# EAGLE design rev2 (EAGLE 8.1.0)
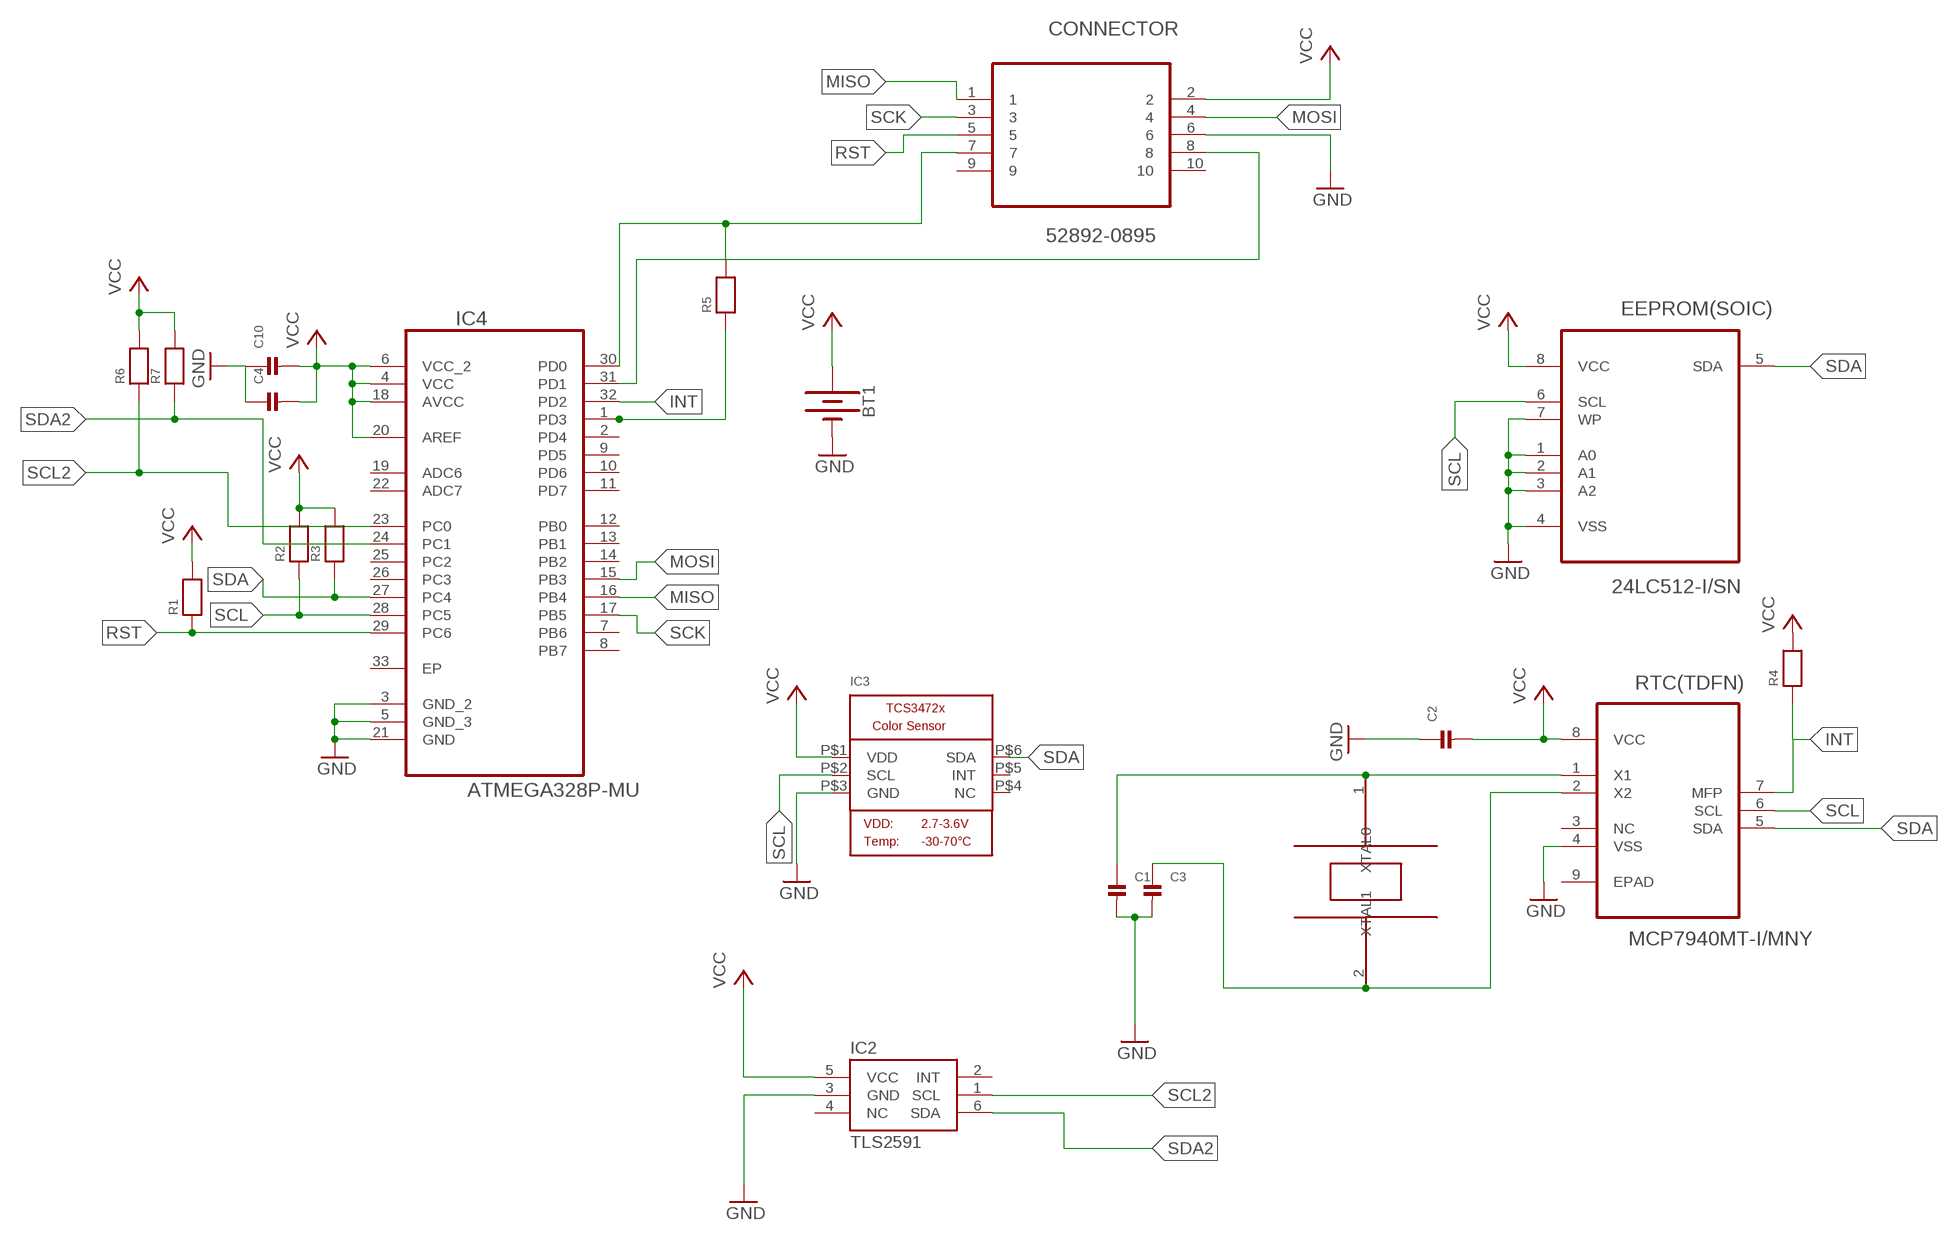
[diagram p0: schematic, sheet 1]

## Parts
BT1  BATTERY-20MM_SMD_4LEGS  [BATTCON_20MM_4LEGS]
C1  CAP_CERAMIC0402  [0402]
C2  CAP_CERAMIC0402  [0402]
C3  CAP_CERAMIC0402  [0402]
C4  CAP_CERAMIC0402  [0402]
C10  CAP_CERAMIC0402  [0402]
CONNECTOR  52892-0895  [MOLEX_52892-0895]
EEPROM(SOIC)  24LC512-I/SN  [SOIC127P600X175-8N]
IC2  TLS2591  [WFDFN6]
IC3  LIGHT_TCS3472  [TCS3472_FN6]
IC4  ATMEGA328P-MU  [QFN50P500X500X100-33N]
R1  RESISTOR0402  [0402]
R2  RESISTOR0402  [0402]
R3  RESISTOR0402  [0402]
R4  RESISTOR0402  [0402]
R5  RESISTOR0402  [0402]
R6  RESISTOR0402  [0402]
R7  RESISTOR0402  [0402]
RTC(TDFN)  MCP7940MT-I/MNY  [TDFN300X200X80-9N]
U$2  FC-135R  [FC-135R]

## Nets
GND: BT1.NEGATIVE(-) C1.2 C2.1 C3.2 C4.1 C10.1 CONNECTOR.6 EEPROM(SOIC).1(A0) EEPROM(SOIC).2(A1) EEPROM(SOIC).3(A2) EEPROM(SOIC).4(VSS) EEPROM(SOIC).7(WP) IC2.3(GND) IC3.P$3(GND) IC4.3(GND_2) IC4.5(GND_3) IC4.21(GND) RTC(TDFN).4(VSS)
INT: IC4.32(PD2) R4.1 RTC(TDFN).7(MFP)
MISO: CONNECTOR.1 IC4.16(PB4)
MOSI: CONNECTOR.4 IC4.15(PB3)
N$1: IC4.1(PD3) R5.1
N$2: C3.1 RTC(TDFN).2(X2) U$2.2(XTAL1)
N$3: C1.1 RTC(TDFN).1(X1) U$2.1(XTAL0)
N$4: CONNECTOR.7 IC4.30(PD0) R5.2
N$5: CONNECTOR.8 IC4.31(PD1)
RST: CONNECTOR.5 IC4.29(PC6) R1.1
SCK: CONNECTOR.3 IC4.17(PB5)
SCL: EEPROM(SOIC).6(SCL) IC3.P$2(SCL) IC4.28(PC5) R2.1
SCL2: IC2.1(SCL) IC4.23(PC0) R6.1
SDA: EEPROM(SOIC).5(SDA) IC3.P$6(SDA) IC4.27(PC4) R3.1 RTC(TDFN).5(SDA)
SDA2: IC2.6(SDA) IC4.24(PC1) R7.1
VCC: BT1.POSITIVE@1(+) BT1.POSITIVE@2(+) BT1.POSITIVE@3(+) BT1.POSITIVE@4(+) C2.2 C4.2 C10.2 CONNECTOR.2 EEPROM(SOIC).8(VCC) IC2.5(VCC) IC3.P$1(VDD) IC4.4(VCC) IC4.6(VCC_2) IC4.18(AVCC) IC4.20(AREF) R1.2 R2.2 R3.2 R4.2 R6.2 R7.2 RTC(TDFN).8(VCC)
Unconnected: CONNECTOR.9 CONNECTOR.10 IC2.2(INT) IC2.4(NC) IC3.P$4(NC) IC3.P$5(INT) IC4.2(PD4) IC4.7(PB6) IC4.8(PB7) IC4.9(PD5) IC4.10(PD6) IC4.11(PD7) IC4.12(PB0) IC4.13(PB1) IC4.14(PB2) IC4.19(ADC6) IC4.22(ADC7) IC4.25(PC2) IC4.26(PC3) IC4.33(EP) RTC(TDFN).3(NC) RTC(TDFN).6(SCL) RTC(TDFN).9(EPAD)

## Library data of the parts
BT1 = SparkFun-Batteries:BATTERY: Battery - Single Cell A variety of battery chemistries, sizes, and footprints. Device List: 20MM_PTH - Coin Cell Battery Holder - 20mm (PTH) <https://www.sparkfun.com/products/783> 12MM_SMD - Coin Cell Battery Holder - 12mm (SMD) <https://www.sparkfun.com/products/10592> 12MM_PTH - Coin Cell Battery Holder - 12mm (PTH) <https://www.sparkfun.com/products/7948> 20MM_SMD - 20mm Coin Cell Battery Holder (SMD) (2 legs) Used on the Big Time Watch Kit <https://www.sparkfun.com/products/11734> 20MM_SMD_4LEGS - Coin Cell Battery Holder - 20mm (SMD) <https://www.sparkfun.com/products/11892> 20MM_SMD_4LEGS_OVERPASTE - Coin Cell Battery Holder - 20mm (SMD) <https://www.sparkfun.com/products/11892> (Over-paste on the legs) 24.5MM_PTH - Coin Cell Battery Holder - 24.5mm (PTH) <https://www.sparkfun.com/products/8863> 9V - 9V Battery Holder - PC Mount Used on the SparkFun SparkPunk Sound Kit <https://www.sparkfun.com/products/11177> and SparkFun SparkPunk Sequencer Kit <https://www.sparkfun.com/products/12707> 18650 - Battery Holder - 18650 (PTH) <https://www.sparkfun.com/products/13113> AA - Battery Holder - 1xAA (PTH) <https://www.sparkfun.com/products/7949> AAA - Battery Holder - 1xAAA (PTH) <https://www.sparkfun.com/products/12718> AA_KIT - Battery Holder - 1xAA (PTH) <https://www.sparkfun.com/products/7949> Special kit package - pads only have exposed copper on one side of the board. AAA_KIT - Battery Holder - 1xAAA (PTH) <https://www.sparkfun.com/products/12718> Special kit package - pads only have exposed copper on one side of the board.; PROD_ID: BATT-10373; SF_SKU: PRT-11892
C1-C4 C10 = microbuilder:CAP_CERAMIC: Ceramic Capacitors 0402 - 0402 Surface Mount Capacitors 16pF 50V 5% [Digikey: 445-4899-2-ND] 18pF 50V 5% [Digikey: 490-1281-2-ND] 22pF 50V 5% [Digikey: 490-1283-2-ND] 68pF 50V 5% [Digikey: 490-1289-2-ND] 0.1uF 10V 10% [Digikey: 490-1318-2-ND] 1.0uF 6.3V 10% [Digikey: 490-1320-2-ND] 0603 - 0603 Surface Mount Capacitors 16 pF 50V 5% [Digikey: 445-5051-2-ND] 22 pF 50V [Digikey: PCC220ACVTR-ND] 33 pF 50V 5% [Digikey: 490-1415-1-ND] 56pF 50V 5% [Digikey: 490-1421-1-ND] 220pF 50V 5% [Digikey: 445-1285-1-ND] 680 pF 50V 2200 pF 50V 5% C0G [Digikey: 445-1297-1-ND] 5600 pF 100V 5% X7R [Digikey: 478-3711-1-ND] 0.1 µF 25V 10% [Digikey: PCC2277TR-ND] 0.22 µF 16V 10% X7R [Digikey: 445-1318-1-ND] 1.0 µF 25V 10% [Digikey: 445-5146-2-ND] 0603 - RF Specific 3pF 250V +/-0.1pF RF [Digikey: 712-1347-1-ND] 18 pF 250V 5% [Digikey: 478-3505-1-ND or 712-1322-1-ND] 56 pF 250V 5% C0G RF [Digikey: 490-4867-1-ND] 68 pF 250V RF [Digikey: 490-4868-1-ND] 0805 - 0805 Surface Mount Capacitors 220 pF 250V 2% RF Ceramic Capacitor [Digikey: 712-1398-1-ND] 1000 pF 50V 2% NP0 Ceramic Capacitor [Digikey: 478-3760-1-ND] 0.1 µF 25V 10% Ceramic Capacitor [Digikey: PCC1828TR-ND] 1.0 µF 16V 10% Ceramic Capacitor[Digikey: 490-1691-2-ND] 10.0 µF 10V 10% Ceramic Capacitor[Digikey: 709-1228-1-ND] 10.0 uF 16V 10% Ceramic Capacitor [Digikey: 478-5165-2-ND] 47 uF 6.3V 20% Ceramic Capacitor [Digikey: 587-1779-1-ND or 399-5506-1-ND] 1206 - 1206 Surface Mount Capacitors 47uF 10V 20% Ceramic Capacitor [Digikey: 490-5528-1-ND or 399-5508-1-ND or 445-6010-1-ND] 100uF 6.3V -20%, +80% Y5V Ceramic Capacitor (Digikey: 490-4512-1-ND, Mouser: 81-GRM31CF50J107ZE1L)
CONNECTOR = molex:52892-0895: CONNECTOR, FPC, ZIF, 0.50MM, 08 WAY; MPN: 52892-0895; OC_FARNELL: 1556803; OC_NEWARK: 95M2692; PACKAGE: CONNECTOR, FPC, ZIF, 0.50MM, 08 WAY; SUPPLIER: Molex
EEPROM(SOIC) = Microchip-24LCxxx:24LC: IC, I2C™ Serial EEPROM; MPN: 24LC512-I/SN; OC_FARNELL: 1801220; OC_NEWARK: 08R2186; PACKAGE: SOIC-8; SUPPLIER: MICROCHIP
IC2 = we-sensor:TLS2591: AMS TSL2591 Light-to-Digital Converter
IC3 = microbuilder:LIGHT_TCS3472: TCS3472 RGB + Clear Color Sensor VDD: 2.7-3.6V Temp: -30 - 70°C IR light blocking filter 3,800,000:1 Dynamic Range 2.5µA sleep state Part IDs TCS34725: I2C bus logic = VDD, I2C address: 0x29 TCS34727: I2C bus logic = 1.8V, I2C address: 0x29
IC4 = 328p:ATMEGA328P-MU: Programmable Flash; MPN: ATMEGA328P-MU; OC_FARNELL: 1748522; OC_NEWARK: 26R2526; PACKAGE: QFN-32; SUPPLIER: Atmel
R1-R7 = microbuilder:RESISTOR: Resistors 0402 - 0402 Surface Mount Package 22 Ohm 1% 1/16W [Digikey: 311-22.0LRTR-ND] 33 Ohm 5% 1/16W 1.0K 5% 1/16W 1.5K 5% 1/16W 2.0K 1% 1/16W 10.0K 1% 1/16W [Digikey: 311-10.0KLRTR-ND] 10.0K 5% 1/16W [Digikey: RMCF0402JT10K0TR-ND] 12.1K 1% 1/16W [Digikey: 311-22.0LRTR-ND] 100.0K 5% 1/16W 0603 - 0603 Surface Mount Package 0 Ohm 1/10 Watt 1% Resistor 15 Ohm 1/10 Watt 1% Resistor 33 Ohm 1/10 Watt 1% Resistor 49.9 Ohm 1/10 Watt 1% Resistor 100 Ohm 1/10 Watt 1% Resistor 150 Ohm 1/10 Watt 1% Resistor 240 Ohm 1/10 Watt 1% Resistor 390 Ohm 1/10 Watt 1% Resistor 560 Ohm 1/10 Watt 1% Resistor 680 Ohm 1/10 Watt 1% Resistor 750 Ohm 1/10 Watt 1% Resistor 1.0K Ohm 1/10 Watt 1% Resistor 1.5K Ohm 1/10 Watt 1% Resistor 2.0K Ohm 1/10 Watt 1% Resistor 2.2K Ohm 1/10 Watt 1% Resistor 3.3K Ohm 1/10 Watt 1% Resistor 4.7K Ohm 1/10 Watt 1% Resistor 10.0K Ohm 1/10 Watt 1% Resistor 12.0K Ohm 1/10 Watt 1% Resistor 12.1K Ohm 1/10 Watt 1% Resistor 20.0K Ohm 1/10 Watt 1% Resistor 33.0K Ohm 1/10 Watt 1% Resistor 100.0K Ohm 1/10 Watt 1% Resistor 0805 - 0805 Surface Mount Package 0 Ohm 1/8 Watt 1% Resistor 33 Ohm 1/8 Watt 1% Resistor 100 Ohm 1/8 Watt 1% Resistor 150 Ohm 1/8 Watt 1% Resistor 200 Ohm 1/8 Watt 1% Resistor 240 Ohm 1/8 Watt 1% Resistor 330 Ohm 1/8 Watt 1% Resistor 390 Ohm 1/8 Watt 1% Resistor 470 Ohm 1/8 Watt 1% Resistor 1.0K Ohm 1/8 Watt 1% Resistor 1.5K Ohm 1/8 Watt 1% Resistor 2.0K Ohm 1/8 Watt 1% Resistor 4.7K Ohm 1/8 Watt 1% Resistor 5.1K Ohm 1/8 Watt 1% Resistor 5.6K Ohm 1/8 Watt 1% Resistor 10.0K Ohm 1/8 Watt 1% Resistor 22.0K Ohm 1/8 Watt 1% Resistor 33.0K Ohm 1/8 Watt 1% Resistor 100K Ohm 1/8 Watt 1% Resistor 1206 - 1206 Surface Mount Package 2012 - 2010 Surface Mount Package 0.11 Ohm 1/2 Watt 1% Resistor - Digikey: RHM.11UCT-ND
RTC(TDFN) = RTC:MCP7940MT-I/MNY: RTC, I2C, 64BYTES SRAM, 8TDFN; MPN: MCP7940MT-I/MNY; OC_FARNELL: 2098893; OC_NEWARK: 79T6326; PACKAGE: TDFN-8; SUPPLIER: Microchip
U$2 = ntnu_lysprosjekt:FC-135R

## Board
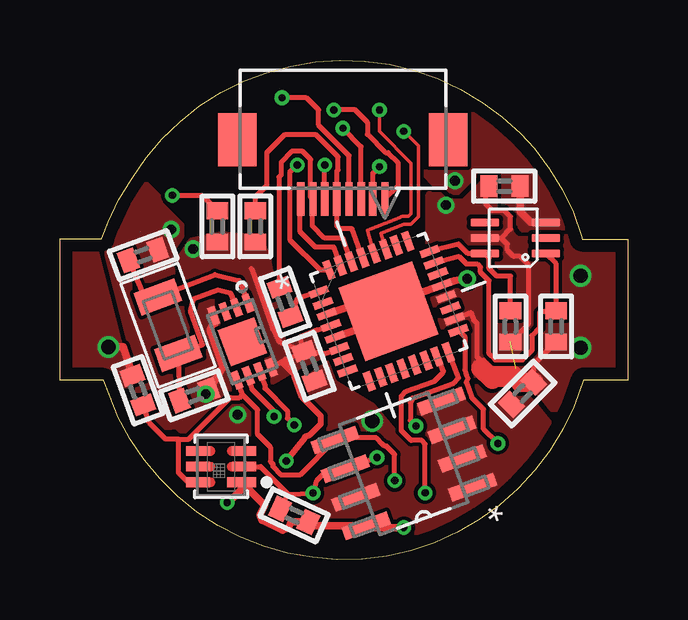
[diagram p1: board, top side]
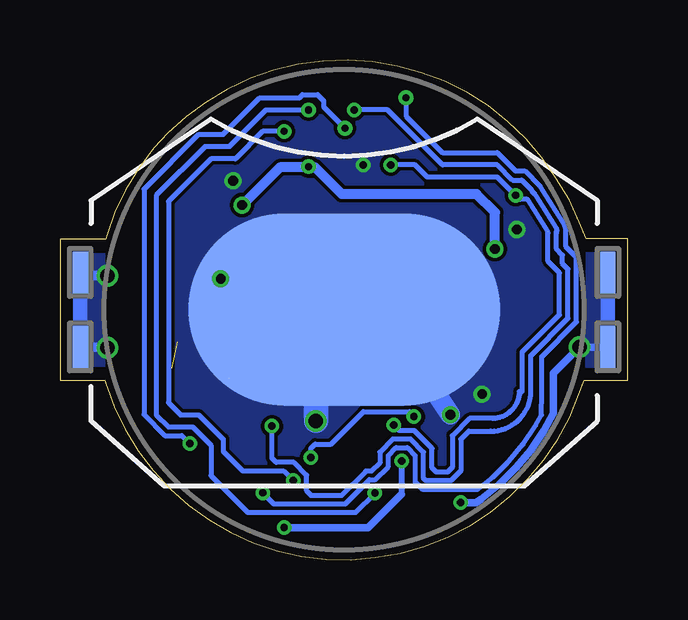
[diagram p2: board, bottom side, seen from below]

Size 23.69 x 20.83 mm. Coordinates in mm from the lower left corner, seen from the top.
Outline: 0,13.37 1.74,13.37 2.02,14.07 2.45,15.01 3.01,15.9 3.59,16.76 4.25,17.55 5.02,18.26 5.83,18.92 6.72,19.48 7.63,19.94 8.62,20.29 9.61,20.57 10.66,20.75 11.67,20.83 12.71,20.78 13.75,20.65 14.77,20.4 15.74,20.07 16.7,19.61 17.59,19.08 18.43,18.47 19.19,17.78 19.77,17.15 20.41,16.31 20.94,15.42 21.4,14.48 21.73,13.51 21.78,13.36 23.69,13.36 23.69,7.49 21.83,7.49 21.78,7.37 21.43,6.38 20.97,5.44 20.43,4.55 19.8,3.73 19.09,2.97 18.33,2.29 17.46,1.68 16.57,1.14 15.63,0.71 14.64,0.38 13.63,0.15 12.59,0.03 11.54,0 10.53,0.1 9.49,0.28 8.5,0.56 7.53,0.94 6.59,1.42 5.73,1.98 4.92,2.64 4.18,3.38 3.52,4.17 2.93,5.03 2.43,5.94 2.04,6.91 1.82,7.48 0,7.48 0,13.37
Copper layers (1*16): Top 0.035mm / dielectric 1.6mm / Bottom 0.035mm
Design rules "Elecrow_2-layer_PCB_eagle_rule": minimum track width 6mil, minimum drill 12mil, track to track 6mil, track to pad 6mil, pad to pad 6mil, via to via 8mil, smd to smd 0mil, copper to edge 20mil, drill to drill 10mil, minimum pad ring 6mil, minimum via ring 6mil, stop-mask expansion 0mil, vias tented up to drill 100mil, thermal gap 10mil

### Footprints (pad centres in the part's own frame; a part is rotated, then mirrored left to right if it is on the bottom)
BATTCON_20MM_4LEGS = smd 13 x 8: NEGATIVE 0,0 | smd 0.635 x 1.727: POSITIVE@1 -10.998,1.549; POSITIVE@2 -10.998,-1.549; POSITIVE@3 10.998,1.549; POSITIVE@4 10.998,-1.549
0402 = smd 0.7 x 0.9: 1 -0.65,0; 2 0.65,0
MOLEX_52892-0895 = smd 0.305 x 1.397: 1 1.753,2.896; 2 1.245,2.896; 3 0.762,2.896; 4 0.254,2.896; 5 -0.254,2.896; 6 -0.762,2.896; 7 -1.245,2.896; 8 -1.753,2.896 | smd 1.6 x 2.21: 9 -4.394,5.359; 10 4.394,5.359
SOIC127P600X175-8N = smd 1.981 x 0.559: 1 -2.362,1.905; 2 -2.362,0.635; 3 -2.362,-0.635; 4 -2.362,-1.905; 5 2.362,-1.905; 6 2.362,-0.635; 7 2.362,0.635; 8 2.362,1.905
WFDFN6 = smd 1.2 x 0.35: 1 -1.35,0.65; 2 -1.35,0; 3 -1.35,-0.65; 4 1.19,-0.65; 5 1.19,0; 6 1.19,0.65
TCS3472_FN6 = smd 1.2 x 0.4: P$1 -0.85,0.65 | smd 1 x 0.4: P$2 -0.95,0; P$3 -0.95,-0.65; P$4 0.95,-0.65; P$5 0.95,0; P$6 0.95,0.65
QFN50P500X500X100-33N = smd 0.813 x 0.305: 1 -2.464,1.753; 2 -2.464,1.245; 3 -2.464,0.762; 4 -2.464,0.254; 5 -2.464,-0.254; 6 -2.464,-0.762; 7 -2.464,-1.245; 8 -2.464,-1.753; 17 2.464,-1.753; 18 2.464,-1.245; 19 2.464,-0.762; 20 2.464,-0.254; 21 2.464,0.254; 22 2.464,0.762; 23 2.464,1.245; 24 2.464,1.753 | smd 0.305 x 0.813: 9 -1.753,-2.464; 10 -1.245,-2.464; 11 -0.762,-2.464; 12 -0.254,-2.464; 13 0.254,-2.464; 14 0.762,-2.464; 15 1.245,-2.464; 16 1.753,-2.464; 25 1.753,2.464; 26 1.245,2.464; 27 0.762,2.464; 28 0.254,2.464; 29 -0.254,2.464; 30 -0.762,2.464; 31 -1.245,2.464; 32 -1.753,2.464 | smd 3.251 x 3.251: 33 0,0
TDFN300X200X80-9N = smd 0.762 x 0.305: 1 -1.422,0.762; 2 -1.422,0.254; 3 -1.422,-0.254; 4 -1.422,-0.762; 5 1.422,-0.762; 6 1.422,-0.254; 7 1.422,0.254; 8 1.422,0.762 | smd 1.6 x 1.6: 9 0,0
FC-135R = smd 1 x 1.8: 1 -1.25,0; 2 1.25,0

### Placement (x,y rotation side)
BT1  11.84,10.43 180 bottom
C1  3.47,12.7 20 top
C2  18.53,15.57 180 top
C3  5.6,6.86 20 top
C4  10.4,8.08 110 top
C10  19.29,6.93 45 top
CONNECTOR  11.8,12.14 0 top
EEPROM(SOIC)  14.34,4.01 200 top
IC2  18.91,13.41 180 top
IC3  6.72,3.89 180 top
IC4  13.7,10.36 20 top
R1  8.14,13.89 270 top
R2  9.77,1.85 335 top
R3  3.25,7.07 110 top
R4  6.57,13.89 270 top
R5  9.39,10.74 110 top
R6  20.69,9.73 270 top
R7  18.78,9.73 270 top
RTC(TDFN)  7.61,9.09 290 top
U$2  4.51,9.78 290 top

### Tracks (layer width: path | path; a pad name or v marks a point on that pad's centre or on a via)
GND  (via drill 0.3 pad 0.3, 0.41 pad 0.3, 0.6)
  Top 0.203: 17.8,3.03 EEPROM(SOIC).1 | 19.18,15.27 C2.1 19.16,15.56 | CONNECTOR.6 v11.04,16.46
  Top 0.305: RTC(TDFN).4 6.47,9.85 6.36,9.81 6.25,9.59 6.81,8.05 C3.2 | IC2.3 19.63,14.06 19.19,14.5 19.19,15.56 C2.1 | 14.16,10.82 14.01,11.25 | 14.16,10.82 IC4.21 16.45,11.63 16.73,11.69 16.74,11.69 16.75,11.69 v16.98,11.71 | IC4.5 13.32,9.93 13.53,10.15 14.16,10.82 | IC4.3 12.79,10.8
  Top 0.406: 12.79,10.8 13.53,10.15
  Bottom 0.203: 11.04,11.51 11.04,11.23
  Bottom 0.813: v7.4,6.05 11.04,11.51
  Bottom 1.016: v13.02,5.79 13.02,9.25
  other vias: 4.64,13.77 16.47,15.8 6.08,6.91
  pour Top (rank 2, no thermals): 22.52,3.12 19.01,7.49 16.5,7.92 16.68,7.52 14.44,6.58 13.65,4.52 12.46,3.1 10.76,2.62 8.7,-0.84 19.6,-1.45 22.52,3.07
  pour Top (rank 3, no thermals): 14.19,5.11 13.04,6.45 11.47,7.39 11.11,8.26 7.43,4.93 4.74,4.85 3.8,1.7 10.07,-1.22 16.8,-0.15 18.3,0.58 14.19,5.13
  pour Top (rank 2, no thermals): 3.42,5.59 1.71,12.83 3.8,14.12 5.09,12.9 7.15,9.93 7.43,7.09 6.44,5.69 3.44,5.49 3.44,5.56
  pour Top (rank 2, no thermals): 7.12,7.14 7.15,7.14 8.17,6.12 8.17,5.23 6.26,5.23 6.24,5.21 5.19,5.21 4.84,5.56 4.97,5.56 5.98,6.58 5.98,6.6 6.49,7.11 7.1,7.11
  pour Top (rank 2, no thermals): 3.37,13.08 4.91,13.08 5.09,13.26 5.09,13.94 4.2,14.83 4.2,15.06 3.34,15.93 2.02,15.93 1.97,15.88 1.89,15.88 1.18,15.16 1.18,14 2.12,13.06 3.37,13.06
  pour Bottom (no thermals): 23.81,21.62 0.34,21.62 -2.15,19.13 -2.15,2.39 -1.38,1.63 2.86,1.63 4.61,-0.13 8.19,-0.13 9.03,-0.97 21.32,-0.97 23.33,1.04 23.33,3.61 26.33,6.6 26.33,19.1 23.86,21.56
  pour Top (no thermals): 20.89,13.74 19.29,13.74 19.19,13.84 19.19,13.94 18.5,14.63 18.5,16.1 18.55,16.15 17.41,16.15 17.31,16.05 17.31,16.03 16.57,15.29 16.37,15.29 16.09,15.57 15.68,15.57 15.18,16.08 15.18,20.83 15.51,21.16 21.3,21.16 22.52,19.94 22.52,15.34 20.94,13.77
INT  (via drill 0.3 pad 0.3)  (1 unrouted)
  Top 0.203: 11.21,12.22 IC4.32 10.84,12.08 9.58,13.35 9.58,16.14 v9.89,16.46 | v4.69,15.19 5.92,15.19 R4.1 | RTC(TDFN).7 8.55,7.26 8.55,7.14 9.49,6.2 9.49,5.89 v9.77,5.61
  Bottom 0.203: v9.89,16.46 8.88,16.46 8.37,15.95 5.45,15.95 v4.69,15.19 | 4.53,15.04 v4.69,15.19 | v4.69,15.19 4.52,15.02 4.2,15.02 3.34,13.66 3.34,13.62 3.34,12.45 2.86,11.96 2.86,10.21 4.41,8.66 4.41,7.04 4.41,7.01 4.53,7.01 arc90 5.65,5.89 6.61,5.89 7.33,5.18 7.33,3.86 7.53,3.66 7.99,3.66 8.17,3.84 8.17,4.64 8.91,5.39 9.54,5.39 v9.77,5.61
MISO  (via drill 0.3 pad 0.3)  (1 unrouted)
  Top 0.203: 13.58,15.06 CONNECTOR.1 14.08,15.57 14.08,16.56 13.68,16.97 13.58,16.97 12.81,17.73 12.81,18.24 12.31,18.75 v11.42,18.75 | IC4.16 16.62,7.57 16.42,7.37 14.69,6.74 14.61,6.55 14.61,5.82 v14.85,5.58
  Bottom 0.203: v11.42,18.75 10.02,18.75 7.73,16.46 5.45,16.46 4.81,15.82 4.43,15.82 4.03,15.42 4.03,15.39 3.9,15.26 3.84,15.17 2.99,13.81 2.99,13.76 | 2.99,13.76 | 2.99,13.76 2.98,13.76 2.96,13.73 2.98,13.63 2.98,12.95 2.73,12.7 2.73,12.34 2.5,12.11 2.5,10.06 4.05,8.51 4.05,7.04 arc90 5.73,5.36 6.64,5.36 6.97,5.03 6.97,3.71 7.38,3.3 8.43,3.3 8.52,3.4 8.52,4.49 9.06,5.03 9.82,5.03 10.35,4.49 10.35,4.03 10.69,3.7 10.93,3.7 11.94,2.69 13.22,2.69 13.4,2.87 13.4,3.53 13.93,4.06 14.67,4.06 14.85,4.24 v14.85,5.58 | 2.99,13.76
MOSI  (via drill 0.3 pad 0.3)
  Top 0.203: v9.26,19.25 10.27,19.25 10.78,18.75 10.78,18.11 12.05,16.84 CONNECTOR.4 | IC4.15 15.99,7.82 15.62,7.45 14.43,7.02 14.23,6.82 14.23,6.59 14.22,6.56 14.23,6.53 | v15.23,2.79 15.23,4.84 15.09,4.98 14.64,4.98 14.24,5.39 14.24,6.52 14.23,6.53 | 14.23,6.53
  Bottom 0.203: v9.26,19.25 9.26,18.49 7.73,16.97 5.45,16.97 4.69,16.21 4.31,16.21 3.67,15.57 2.64,13.93 2.63,13.91 | v15.23,2.79 14.77,2.34 11.79,2.34 10.79,3.34 10.54,3.34 10,3.89 10,4.35 9.67,4.67 9.2,4.67 8.88,4.35 8.88,3.25 8.57,2.95 6.25,2.95 5.64,3.44 5.06,4.03 | 2.63,13.91 | 2.61,13.86 2.63,13.91 | 2.61,13.86 2.59,13.83 | 5.06,4.03 5.28,3.8 | 5.06,4.03 4.98,4.1 | 4.98,4.1 | 4.98,4.1 4.98,4.11 4.38,4.82 3.85,5.6 3.61,6.03 3.59,6.96 3.59,8.47 2.15,9.92 2.15,12.62 2.58,13.06 2.58,13.79 2.61,13.84 2.61,13.86
N$1
  Top 0.203: IC4.1 9.89,10.87 R5.1
N$2
  Top 0.203: 4.71,8.53 U$2.2 | U$2.2 5.96,8.97 5.45,10.36 5.58,10.87 6.59,11.25 7.1,11.13 RTC(TDFN).2 | 4.18,8.46 U$2.2 | U$2.2 C3.1
N$3
  Top 0.203: RTC(TDFN).1 7.48,11.63 6.46,11.89 U$2.1 3.58,10.82 C1.1
N$4
  Top 0.203: 12.14,12.56 IC4.30 11.8,13.41 11.04,13.41 10.53,13.92 10.53,15.01 CONNECTOR.7 | 9.27,11.36 R5.2 9.13,11.39 9.13,15.95 9.22,16.04 9.22,16.58 9.66,17.02 10.12,17.02 10.45,16.69 10.45,15.1 CONNECTOR.7 | CONNECTOR.7 10.53,15.06 CONNECTOR.7
N$5
  Top 0.203: 11.69,12.38 IC4.31 11.42,13.03 10.66,13.03 10.02,13.67 10.02,15.01 CONNECTOR.8
N$7
  Top 0.203: 8.04,7.06 7.84,7.72
RST
  Top 0.203: 12.62,12.71 IC4.29 12.18,13.79 11.67,13.79 11.54,13.92 CONNECTOR.5 11.54,16.2 11.6,16.25 11.6,16.79 10.68,17.71 9.36,17.71 8.62,16.97 8.62,15.6 8.14,15.11 R1.1
SCK  (via drill 0.3 pad 0.3)
  Top 0.203: CONNECTOR.3 12.56,17.22 v11.8,17.98 | IC4.17 16.88,9.3 16.88,7.91 16.91,7.83 16.96,7.7 17.01,7.56 17.01,7.55 16.95,7.42 16.94,7.4 17.18,6.76 17.67,6.27 17.67,5.45 v18.26,4.85
  Bottom 0.203: v11.8,17.98 12.69,18.87 12.69,19.13 12.94,19.38 13.58,19.38 13.7,19.25 15.35,19.25 16.88,17.73 17.89,17.73 20.18,15.44 20.18,6.05 19.31,5.18 18.59,5.18 v18.26,4.85
SCL  (via drill 0.3, 0.3 pad 0.3)
  Top 0.152: IC4.28 12.81,13.73 13.96,14.17 14.19,14.27 14.21,14.29 14.27,14.31 14.53,14.31 14.64,14.43 14.64,16.54 13.32,17.86 v13.32,18.75
  Top 0.203: R2.1 9.26,1.79 | EEPROM(SOIC).6 11.73,3.63 11.04,3.63 10.72,3.31 v10.55,2.78 9.51,2.74 | R2.1 9.18,2.34 | 9.51,2.74 8.37,3.89 IC3.P$2 | 9.51,2.74 R2.1 | v8.93,5.97 8.93,6.2 8.06,7.07 | EEPROM(SOIC).6 12.37,3.8 12.56,3.99 | EEPROM(SOIC).6 v13.22,4.27
  Bottom 0.203: v13.32,18.75 15.1,18.75 16.62,17.22 17.64,17.22 19.67,15.19 19.67,6.05 19.16,5.54 18.15,5.54 17.39,4.78 17.39,3.51 15.86,1.98 11.35,1.98 v10.55,2.78 | v8.93,5.97 8.93,5.99 9.11,6.17 11.04,6.17 12.38,4.83 13.04,4.83 13.22,4.65 v13.22,4.27
SCL2
  Top 0.203: 20.56,10.25 R6.1 | R6.1 20.67,10.36 20.05,10.36 19.99,10.3 19.99,9.66 19.67,9.35 19.67,8.71 19.29,8.33 18.15,8.33 17.89,8.59 17.89,11.64 17.54,11.99 17.54,12.19 17.4,12.33 16.95,12.33 16.63,12.65 16.62,12.65 IC4.23 | IC2.1 20.69,12.33 R6.1
SDA  (via drill 0.3 pad 0.3)
  Top 0.152: IC4.27 13.39,13.6 14.34,13.98 14.63,13.98 14.95,14.3 14.95,17.25 v14.34,17.86
  Top 0.203: EEPROM(SOIC).5 11.76,5.28 | 10.78,4.78 11.25,4.78 EEPROM(SOIC).5 | IC3.P$6 5.34,3.24 4.94,3.63 4.94,5.03 | 7.4,7.47 RTC(TDFN).5 7.61,6.88 | R3.1 3.72,5.72 4.41,5.03 4.94,5.03 | EEPROM(SOIC).5 11.13,5 | 7.61,6.88 8.24,6.25 8.24,5.23 8.78,4.7 8.78,4.09 8.88,3.99 8.88,3.88 9.2,3.56 10.03,3.56 EEPROM(SOIC).5 | 4.94,5.03 5.37,5.03 7.1,6.76 7.48,6.76 7.61,6.88 | EEPROM(SOIC).5 11.56,5.09 13.19,5.09 13.45,4.83 13.54,4.74 13.62,4.74 13.96,4.4 v13.96,3.3
  Bottom 0.203: v14.34,17.86 15.23,17.86 16.37,16.71 17.39,16.71 19.16,14.94 19.16,6.55 18.66,6.05 17.89,6.05 16.88,5.03 16.88,4.52 16.07,3.71 14.36,3.71 v13.96,3.3
SDA2
  Top 0.203: IC4.24 16.62,13.16 17.02,12.76 IC2.6 17.89,12.59 17.89,12.14 18.21,11.83 18.78,11.83 R7.1
VCC  (via drill 0.3, 0.3 pad 0.3, 0.41 pad 0.3, 0.6)  (1 unrouted)
  Top 0.203: 19.7,7.19 C10.2 | C10.2 19.42,7.39 19.06,7.75 19.06,7.93 19.01,7.98 18,7.98 17.66,8.32 17.53,8.32 17.39,8.46 17.39,9.86 17.26,9.98 17.13,10.31 IC4.18 | C10.2 19.75,8.14 R6.2 | IC4.4 10.75,9.58 10.02,9.28 C4.2 | 7.99,12.14 8.84,9.71 | 8.84,9.71 8.88,9.6 | 12.43,1.07 EEPROM(SOIC).8 | 18.91,9.21 R7.2 19.55,9.84 19.55,12.27 19.16,12.65 18.91,12.65 18.66,12.9 18.66,13.16 18.4,13.41 | 10.36,1.43 R2.2 | 18.4,13.41 IC2.5 | 18.4,13.41 18.78,13.79 18.78,14.3 18.53,14.55 18.02,14.55 17.77,14.81 17.77,15.46 C2.2 | IC4.6 11.04,8.59 C4.2 | C4.2 9.42,8.32 9.25,8.24 RTC(TDFN).8 | 8.84,9.71 9.13,9.09 C4.2 | CONNECTOR.2 13.04,16.1 v13.32,16.38
  Top 0.254: v9.44,4.12 10.22,5.1 10.24,5.14 10.43,5.21 10.88,5.66 10.88,5.99 10.1,6.78 | 10.07,6.85 10.1,6.78 | 10.1,6.78 9.78,7.65 9.8,7.69 9.25,8.24
  Top 0.305: v14.34,1.35 12.84,1.35 EEPROM(SOIC).8 10.52,1.42 R2.2 9.64,1.58 9.53,1.33 9.29,1.24 8.43,1.65 8.34,1.88 8.53,2.28 IC3.P$1 7.57,2.93 7.05,2.41 7,2.41 v6.97,2.39 | 9.42,8.32 9.51,8.22 9.44,8.14 | R3.2 2.63,8.89 2.04,8.89
  Top 0.813: C10.2 19.2,7.39 18.99,7.6 18.1,7.6 18.03,7.52 17.56,7.99
  Bottom 0.203: v13.32,16.38 13.04,16.36
  Bottom 0.254: v9.44,4.12 9.44,2.74
  Bottom 0.305: v6.97,2.39 6.34,2.39 6.12,2.53 5.37,3.14 4.68,3.83 4.06,4.57 3.51,5.38 3.11,6.1 3.11,7.78 v2.02,8.86 0.85,8.86 BT1.POSITIVE@1 | 9.44,2.74 10.83,1.35 v14.34,1.35
  Bottom 0.406: v21.7,8.84 BT1.POSITIVE@3 | v21.7,11.84 22.7,11.84 BT1.POSITIVE@4 | v16.09,14.78 14.52,16.36 13.04,16.36 11.93,15.24 6.31,15.24 5.55,14.48 v5.55,12.95
  Bottom 0.61: BT1.POSITIVE@1 BT1.POSITIVE@2 | BT1.POSITIVE@4 BT1.POSITIVE@3
  pour Top (rank 3, no thermals): 21.15,16.84 21.12,16.87 17.87,16.87 16.57,15.57 16.45,15.57 15.71,15.57 15.33,15.19 15.33,10.62 15.33,9.5 17.13,7.7 18.45,7.7 19.88,6.27 20.15,6.27 24.02,6.27 24.22,6.48 24.22,14.78 22.14,16.87 21.15,16.87
  pour Top (no thermals): 8.47,8.15 8.78,7.34 10.22,8.18 10.83,8.43 10.5,9.4 9.33,9.04 8.72,12.5 8.37,13.44 6.74,13.59 5.45,13.31 4.94,12.55 5.37,11.58 6.64,12.04 7.58,11.53 8.5,8.13
  pour Top (no thermals): 2.81,7.34 -1.05,7.34 -1.05,7.82 -1.03,7.82 -1.03,13.87 1.18,13.87 1.18,13.72 2.81,7.37
  pour Bottom (no thermals): 23.13,12.78 21.83,12.78 21.83,8.05 23.13,8.05
  pour Bottom (no thermals): 1.74,12.83 0.52,12.83 0.52,7.98 1.77,7.98